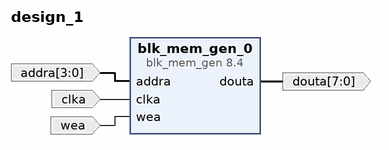
[diagram p0: block diagram of the top level]
# Vivado block design design_1, xc7a50ticsg324-1L, Vivado 2018.3
create_bd_design design_1

create_bd_port -dir I -from 3 -to 0 addra
create_bd_port -dir I -type clk clka
create_bd_port -dir O -from 7 -to 0 douta
create_bd_port -dir I wea

create_bd_cell -type ip -vlnv xilinx.com:ip:blk_mem_gen:8.4 blk_mem_gen_0
set_property -dict [list \
  CONFIG.Coe_File ../../../../../../../../memory.coe \
  CONFIG.Enable_32bit_Address false \
  CONFIG.Enable_A Always_Enabled \
  CONFIG.Load_Init_File true \
  CONFIG.Read_Width_A 8 \
  CONFIG.Register_PortA_Output_of_Memory_Primitives true \
  CONFIG.Use_Byte_Write_Enable false \
  CONFIG.Use_RSTA_Pin false \
  CONFIG.Write_Depth_A 16 \
  CONFIG.Write_Width_A 8 \
  CONFIG.use_bram_block Stand_Alone \
] [get_bd_cells blk_mem_gen_0]

# ---- connections ----

connect_bd_net [get_bd_ports addra] [get_bd_pins blk_mem_gen_0/addra]
connect_bd_net [get_bd_ports clka] [get_bd_pins blk_mem_gen_0/clka]
connect_bd_net [get_bd_ports wea] [get_bd_pins blk_mem_gen_0/wea]
connect_bd_net [get_bd_pins blk_mem_gen_0/douta] [get_bd_ports douta]

validate_bd_design
save_bd_design
